# EAGLE design cn3704 (EAGLE 7.6.0)
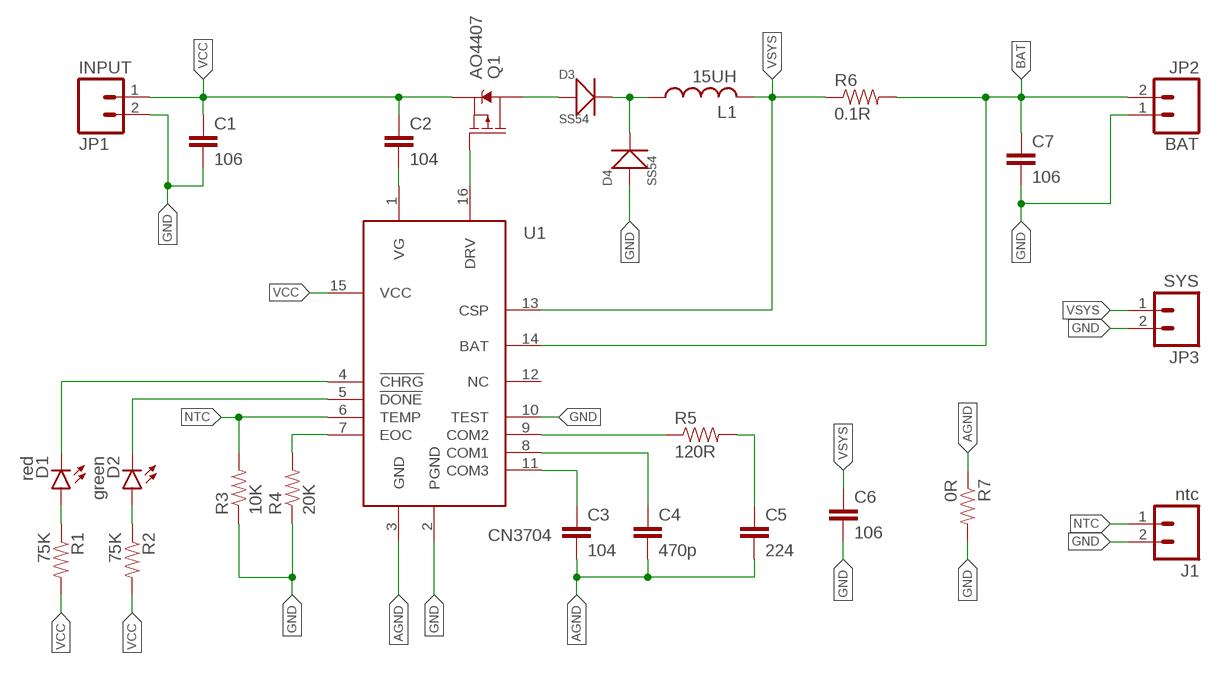
[diagram p0: schematic, sheet 1]

## Parts
C1  106  CAP1206  [1206]
C2  104  CAP0603-CAP  [0603-CAP]
C3  104  CAP-SEEED-0402  [C0402]
C4  470p  CAP-SEEED-0402  [C0402]
C5  224  CAP-SEEED-0402  [C0402]
C6  106  CAP1206  [1206]
C7  106  CAP1206  [1206]
D1  red  LED-SEEED-0603  [LED-0603-SEEED]
D2  green  LED-SEEED-0603  [LED-0603-SEEED]
D3  SS54  SMD-DIODE-SCHOTTKY-40V-3A(DO-214AB)  [DO-214AB]
D4  SS54  SMD-DIODE-SCHOTTKY-40V-1A(DO-214AC)  [DO-214AC]
J1  ntc  M021X02_NO_SILK  [1X02_NO_SILK]
JP1  INPUT  M025MM  [SCREWTERMINAL-5MM-2]
JP2  BAT  M025MM  [SCREWTERMINAL-5MM-2]
JP3  SYS  M025MM  [SCREWTERMINAL-5MM-2]
L1  15UH  L-SMDRI-127  [L_SMDRI-127]
Q1  AO4407  MOSFET_PCH-NDS8434  [SO08]
R1  75K  RESISTOR-SEEED-0402  [R0402]
R2  75K  RESISTOR-SEEED-0402  [R0402]
R3  10K  RESISTOR-SEEED-0402  [R0402]
R4  20K  RESISTOR-SEEED-0402  [R0402]
R5  120R  RESISTOR-SEEED-0402  [R0402]
R6  0.1R  RESISTOR2512  [R2512]
R7  0R  RESISTOR-SEEED-0402  [R0402]
U1  CN3704  CN3702  [TSSOP16]

## Nets
AGND: C3.2 C4.2 C5.2 R7.1 U1.3(GND)
BAT: C7.1 JP2.2 R6.2 U1.14(BAT)
GND: C1.2 C6.2 C7.2 D4.1(+) J1.2 JP1.2 JP2.1 JP3.2 R3.1 R4.1 R7.2 U1.2(PGND) U1.10(TEST)
N$1: C2.2 U1.1(VG)
N$2: D1.-(C) U1.4(!CHRG)
N$4: D2.-(C) U1.5(!DONE)
N$5: D1.+(A) R1.1
N$6: D2.+(A) R2.1
N$7: R4.2 U1.7(EOC)
N$8: C3.1 U1.11(COM3)
N$9: C4.1 U1.8(COM1)
N$10: Q1.4(G) U1.16(DRV)
N$11: R5.1 U1.9(COM2)
N$12: C5.1 R5.2
NTC: J1.1 R3.2 U1.6(TEMP)
SW1: D3.1(+) Q1.5(D) Q1.6(D) Q1.7(D) Q1.8(D)
SW2: D3.2(-) D4.2(-) L1.1
VCC: C1.1 C2.1 JP1.1 Q1.1(S) Q1.2(S) Q1.3(S) R1.2 R2.2 U1.15(VCC)
VSYS: C6.1 JP3.1 L1.2 R6.1 U1.13(CSP)
Unconnected: U1.12(NC)

## Library data of the parts
C1 C2 C6 C7 = xmgu2008:CAP: Capacitor Standard 0603 ceramic capacitor, and 0.1" leaded capacitor.
C3-C5 = z_jlc_smt:CAP: Capacitor Standard 0603 ceramic capacitor, and 0.1" leaded capacitor.
D1 D2 = z_jlc_smt:LED: LEDs Standard schematic elements and footprints for 5mm, 3mm, 1206, and 0603 sized LEDs. 5mm - Spark Fun Electronics SKU : COM-00529 (and others)
D3 = Seeed-OPL-Diode:SMD-DIODE-SCHOTTKY-40V-3A(DO-214AB): 304020018; MPN: SS34-E3/57T; VALUE: 40V-3A
D4 = Seeed-OPL-Diode:SMD-DIODE-SCHOTTKY-40V-1A(DO-214AC): 304020027; MPN: 1N5819; VALUE: 40V-1A
J1 = SparkFun-Connectors:M02: Standard 2-pin 0.1" header. Use with - straight break away headers ( PRT-00116) - right angle break away headers (PRT-00553) - swiss pins (PRT-00743) - machine pins (PRT-00117) - female headers (PRT-00115) Molex polarized connector foot print use with: PRT-08233 with associated crimp pins and housings. 2.54_SCREWTERM for use with PRT-10571. 3.5mm Screw Terminal footprints for PRT-08084 5mm Screw Terminal footprints for use with PRT-08432
JP1-JP3 = xmgu2008:M02: Standard 2-pin 0.1" header. Use with - straight break away headers ( PRT-00116) - right angle break away headers (PRT-00553) - swiss pins (PRT-00743) - machine pins (PRT-00117) - female headers (PRT-00115) Molex polarized connector foot print use with: PRT-08233 with associated crimp pins and housings. 2.54_SCREWTERM for use with PRT-10571. 3.5mm Screw Terminal footprints for PRT-08084 5mm Screw Terminal footprints for use with PRT-08432; STOREFRONT_ID: PRT-08432
L1 = xmgu2008:L
Q1 = xmgu2008:MOSFET_PCH: P-channel MOSFETs Voltage controlled devices that allow control of high current outputs. SparkFun Products: SparkFun ESP32 Thing <https://www.sparkfun.com/products/13907> SparkFun ESP8266 Thing <https://www.sparkfun.com/products/13231>; PROD_ID: TRANS-08355; VALUE: 6.5A/20V/35mΩ
R1-R5 R7 = z_jlc_smt:RESISTOR: Resistor Basic schematic elements and footprints for 0603, 1206, and PTH resistors.
R6 = xmgu2008:RESISTOR: Resistor Basic schematic elements and footprints for 0603, 1206, and PTH resistors.
U1 = xmgu2008:CN3702

## Board
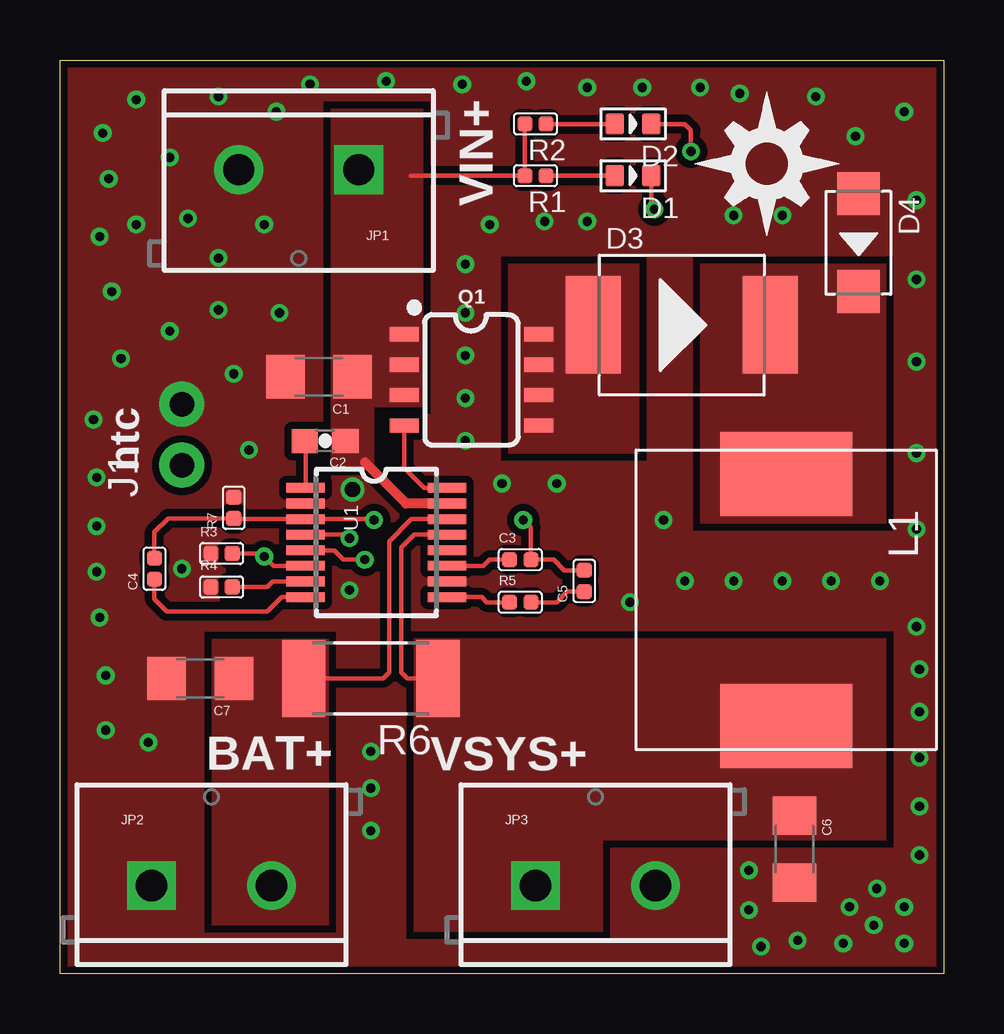
[diagram p1: board, top side]
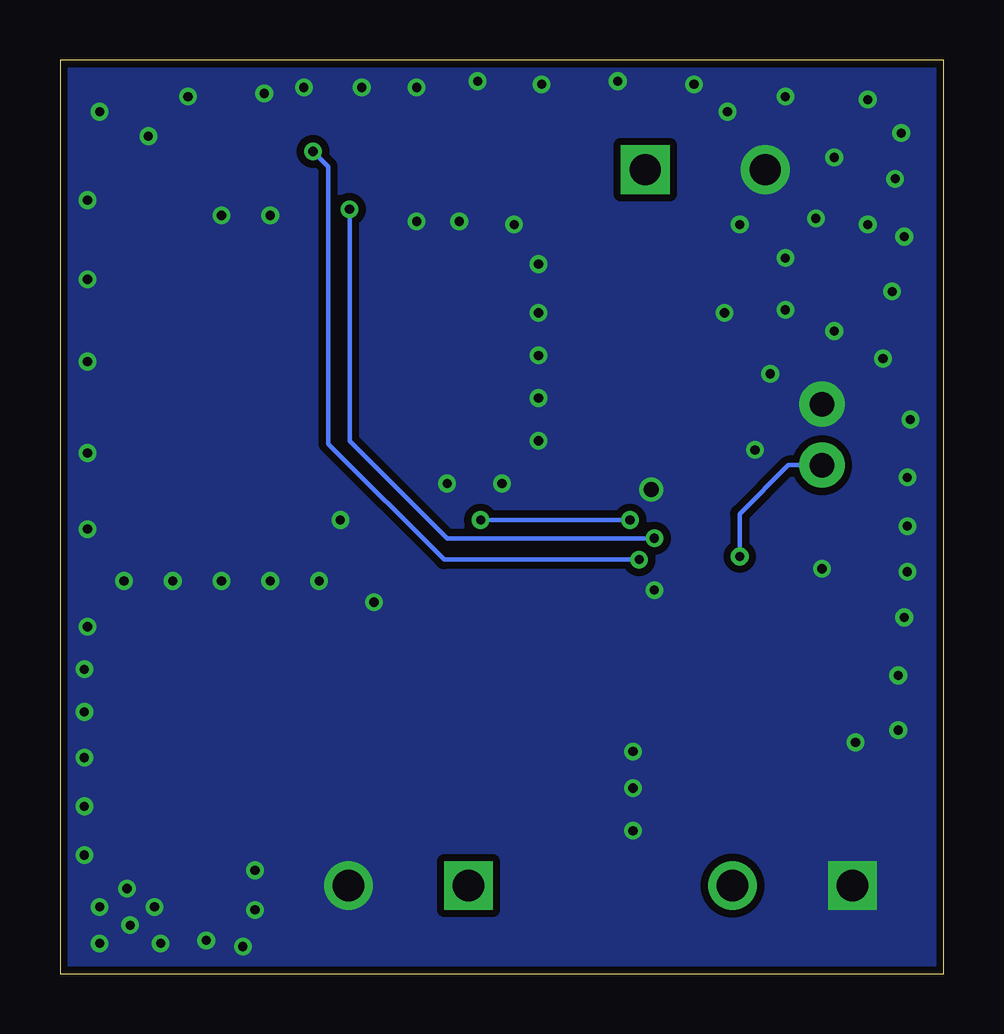
[diagram p2: board, bottom side, seen from below]

Size 36.83 x 38.1 mm. Coordinates in mm from the lower left corner, seen from the top.
Outline: 0,38.1 36.83,38.1 36.83,0 0,0 0,38.1
Copper layers (1*16): Top 0.035mm / dielectric 1.5mm / Bottom 0.035mm
Design rules "SparkFun-2-layer-TIGHT": minimum track width 7mil, minimum drill 15mil, track to track 7mil, track to pad 7mil, pad to pad 7mil, via to via 7mil, smd to smd 7mil, copper to edge 7mil, drill to drill 7mil, minimum pad ring 7mil, minimum via ring 7mil, stop-mask expansion 4mil, vias tented up to drill 20mil, thermal gap 10mil

### Footprints (pad centres in the part's own frame; a part is rotated, then mirrored left to right if it is on the bottom)
1206 = smd 1.6 x 1.8: 1 -1.4,0; 2 1.4,0
0603-CAP = smd 1.1 x 1: 1 -0.85,0; 2 0.85,0
C0402 = smd 0.635 x 0.635: 1 -0.445,0; 2 0.445,0
LED-0603-SEEED = smd 0.762 x 0.889: + 0.762,0; - -0.762,0
DO-214AB = smd 2.286 x 4.064: 1 -3.683,0; 2 3.683,0
DO-214AC = smd 1.8 x 1.77: 1 -2.042,0; 2 2.042,0
1X02_NO_SILK = drill 1.016 pad 1.88: 1 0,0; 2 2.54,0
SCREWTERMINAL-5MM-2 = drill 1.3 pad 2.032 square: 1 0,0 | drill 1.3 pad 2.032: 2 5,0
L_SMDRI-127 = smd 3.5 x 5.5: 1 -5.35,-0.1; 2 5.15,-0.1
SO08 = smd 0.6 x 1.2: 1 -1.905,-2.8; 2 -0.635,-2.8; 3 0.635,-2.8; 4 1.905,-2.8; 5 1.905,2.8; 6 0.635,2.8; 7 -0.635,2.8; 8 -1.905,2.8
R0402 = smd 0.635 x 0.635: 1 -0.445,0; 2 0.445,0
R2512 = smd 1.8 x 3.2: 1 -2.8,0; 2 2.8,0
TSSOP16 = smd 0.4 x 1.6: 1 -2.225,-2.85; 2 -1.575,-2.85; 3 -0.925,-2.85; 4 -0.275,-2.85; 5 0.375,-2.85; 6 1.025,-2.85; 7 1.675,-2.85; 8 2.325,-2.85; 9 2.325,3.05; 10 1.675,3.05; 11 1.025,3.05; 12 0.375,3.05; 13 -0.275,3.05; 14 -0.925,3.05; 15 -1.575,3.05; 16 -2.225,3.05

### Placement (x,y rotation side)
C1  10.79,24.89 180 top
C2  11.05,22.23 180 top
C3  19.18,17.27 0 top
C4  3.94,16.89 90 top
C5  21.84,16.38 90 top
C6  30.61,5.21 270 top
C7  5.84,12.32 180 top
D1  23.88,33.27 180 top
D2  23.88,35.43 180 top
D3  25.91,27.05 0 top
D4  33.27,30.48 270 top
J1  5.08,21.21 90 top
JP1  12.45,33.53 180 top
JP2  3.81,3.68 0 top
JP3  19.81,3.68 0 top
L1  30.35,15.49 270 top
Q1  17.14,24.77 270 top
R1  19.81,33.27 180 top
R2  19.81,35.43 180 top
R3  6.73,17.53 0 top
R4  6.73,16.13 0 top
R5  19.18,15.49 0 top
R6  12.95,12.32 180 top
R7  7.24,19.43 90 top
U1  13.08,18.03 270 top
U$1  [DIYNOVA_LOGO]  26.42,30.73 0 top

### Tracks (layer width: path | path; a pad name or v marks a point on that pad's centre or on a via)
AGND  (via drill 0.38)
  Top 0.178: v13.08,18.92 13.04,18.96 U1.3 7.27,18.96 R7.1 4.51,18.99 3.94,18.41 C4.2 | v19.3,18.92 19.62,18.61 C3.2 20.57,17.27 21.02,16.83 C5.2
  Bottom 0.178: v13.08,18.92 v19.3,18.92
BAT
  Top 0.178: U1.14 14.64,18.96 13.72,18.03 13.72,12.57 13.46,12.32 R6.2
  pour Top (isolate 0.305, no thermals): 6.35,13.97 11.18,13.97 11.18,2.03 6.35,2.03
GND  (via drill 0.38, 0.64)
  other vias: 12.19,20.19 7.87,21.84 9.14,27.56 7.24,25.02 12.06,16 5.08,16.89 21.97,31.37 20.19,31.37 28.07,31.62 30.1,31.62 33.15,34.92 16.89,29.59 16.89,27.56 16.89,25.78 16.89,24 16.89,22.23 20.7,20.45 18.41,20.45 26.04,16.38 28.07,16.38 30.1,16.38 32.13,16.38 34.16,16.38 34.04,3.56 35.18,2.79 33.91,2.03 35.18,1.27 32.64,1.27 30.73,1.4 29.21,1.14 28.7,2.67 28.7,4.32 35.81,4.95 35.81,6.99 32.89,2.79 12.95,9.27 12.95,7.75 12.95,5.97 3.68,9.65 1.91,10.16 1.91,12.45 1.65,14.86 1.52,16.76 1.52,18.67 1.52,20.7 1.4,23.11 2.54,25.65 2.16,28.45 4.57,26.8 6.6,27.69 6.6,29.84 3.17,31.24 2.03,33.15 1.78,35.05 3.17,36.45 4.57,34.04 5.33,31.5 8.51,31.24 6.6,36.58 9.02,35.94 28.32,36.7 31.5,36.58 35.18,35.94 35.69,32.26 35.69,28.96 35.69,25.53 35.69,21.72 35.69,18.54 35.69,14.48 35.81,12.7 35.81,10.92 35.81,9.02 25.15,18.92 23.75,15.49 17.91,31.24 19.43,37.21 21.97,36.96 24.26,36.96 26.67,36.96 16.76,37.08 13.59,37.21 10.41,37.08 1.65,30.73
  pour Top (isolate 0.305, rank 3, no thermals): 0,38.1 36.83,38.1 36.83,0 0,0
  pour Bottom (isolate 0.305, no thermals): 0,38.1 36.83,38.1 36.83,0 0,0
N$1
  Top 0.178: U1.1 10.23,22.19 C2.2
N$2  (via drill 0.38)
  Top 0.178: U1.4 11.92,18.31 v12.06,18.16 | D1.- 24.64,32 v24.77,31.88
  Bottom 0.178: v12.06,18.16 20.7,18.16 24.77,22.23 v24.77,31.88
N$4  (via drill 0.38)
  Top 0.178: U1.5 11.42,17.66 11.81,17.27 v12.7,17.27 | v26.29,34.29 26.29,35.18 26.04,35.43 D2.-
  Bottom 0.178: v12.7,17.27 20.83,17.27 25.65,22.1 25.65,33.66 v26.29,34.29
N$5
  Top 0.178: R1.1 D1.+
N$6
  Top 0.178: R2.1 D2.+
N$7
  Top 0.178: U1.7 8.87,16.36 8.64,16.13 R4.2
N$8
  Top 0.178: U1.11 17.64,17.01 17.91,17.27 C3.1
N$9
  Top 0.178: U1.8 9.23,15.71 8.64,15.11 4.45,15.11 3.94,15.62 C4.1
N$10
  Top 0.178: U1.16 15.17,20.26 14.35,21.08 14.35,22.85 Q1.4
N$11
  Top 0.178: U1.9 17.57,15.71 17.78,15.49 R5.1
N$12
  Top 0.178: R5.2 20.7,15.49 21.14,15.94 C5.1
NTC  (via drill 0.38)
  Top 0.178: U1.6 8.9,17.01 v8.51,17.4 8.38,17.53 R3.2
  Bottom 0.178: J1.1 6.48,21.21 8.51,19.18 v8.51,17.4
SW1
  pour Top (isolate 0.305, no thermals): 24.13,29.59 18.67,29.59 18.67,21.72 24.13,21.72
SW2
  pour Top (isolate 0.305, no thermals): 34.42,29.59 26.67,29.59 26.67,18.8 34.42,18.8
VCC
  Top 0.178: 14.61,33.27 R1.2 R2.2
  Top 0.406: U1.15 14.43,19.61 12.7,21.34
  pour Top (isolate 0.305, no thermals): 15.11,23.62 13.08,23.62 13.08,21.08 11.3,21.08 11.3,36.07 15.11,36.07
VSYS
  Top 0.178: U1.13 14.75,18.31 14.22,17.78 14.22,12.57 14.48,12.32 R6.1
  pour Top (isolate 0.305, no thermals): 34.42,13.97 14.73,13.97 14.73,1.78 22.61,1.78 22.61,5.59 34.42,5.59

### Text on the board
tPlace: VIN+ | ntc | VSYS+ | BAT+